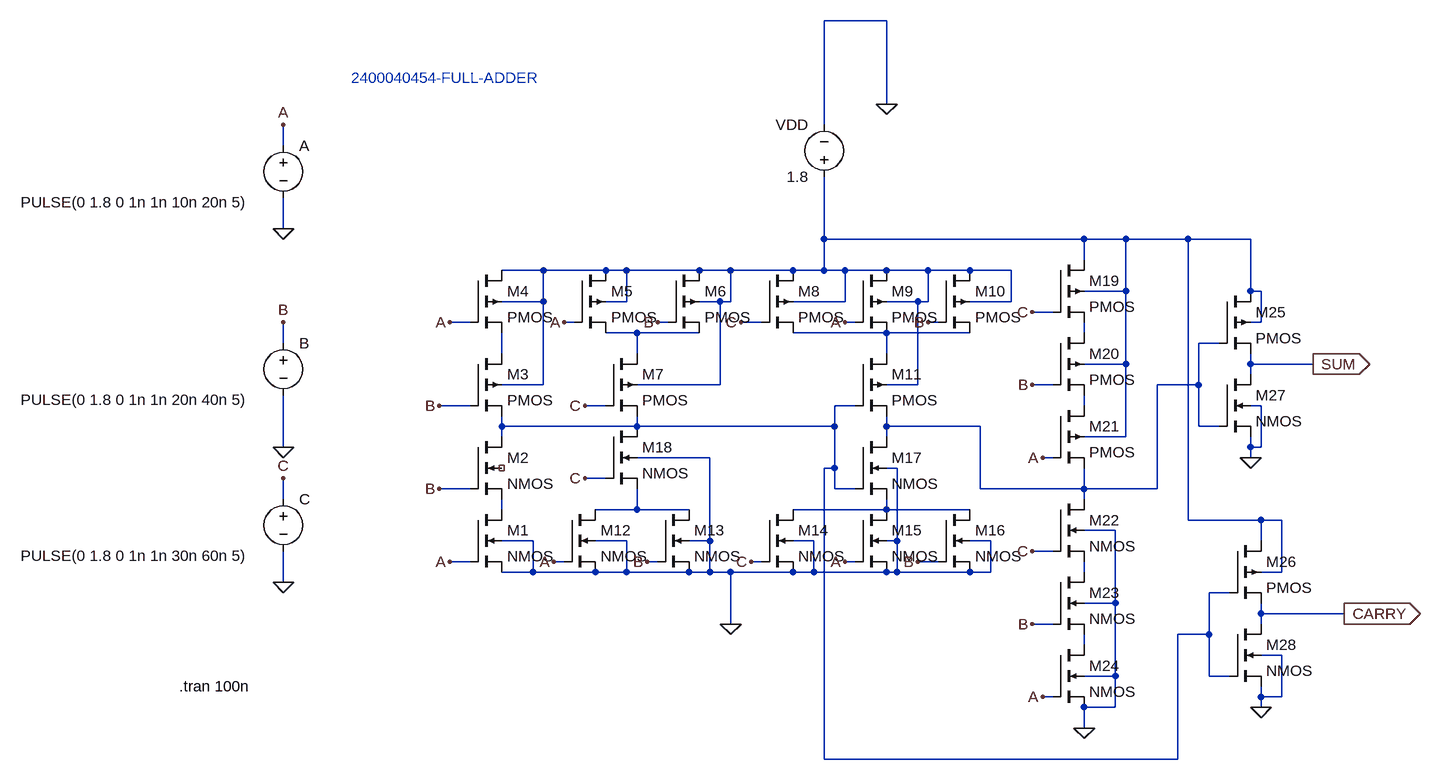
[diagram p0: schematic FULL-ADDER.asc]
FULL-ADDER.asc, the LTspice schematic file:
Version 4.1
SHEET 1 1404 680
WIRE 560 -512 464 -512
WIRE 560 -384 560 -512
WIRE 464 -352 464 -512
WIRE -368 -320 -368 -352
WIRE -368 -192 -368 -240
WIRE 464 -176 464 -272
WIRE 864 -176 464 -176
WIRE 928 -176 864 -176
WIRE 1024 -176 928 -176
WIRE 1120 -176 1024 -176
WIRE 864 -144 864 -176
WIRE 32 -128 -32 -128
WIRE 128 -128 32 -128
WIRE 160 -128 128 -128
WIRE 272 -128 160 -128
WIRE 320 -128 272 -128
WIRE 416 -128 320 -128
WIRE 464 -128 464 -176
WIRE 464 -128 416 -128
WIRE 496 -128 464 -128
WIRE 560 -128 496 -128
WIRE 624 -128 560 -128
WIRE 688 -128 624 -128
WIRE 752 -128 688 -128
WIRE 928 -96 928 -176
WIRE 928 -96 864 -96
WIRE 1120 -96 1120 -176
WIRE 1136 -96 1120 -96
WIRE 32 -80 32 -128
WIRE 32 -80 -32 -80
WIRE 160 -80 160 -128
WIRE 160 -80 128 -80
WIRE 304 -80 272 -80
WIRE 320 -80 320 -128
WIRE 320 -80 304 -80
WIRE 496 -80 496 -128
WIRE 496 -80 416 -80
WIRE 608 -80 560 -80
WIRE 624 -80 624 -128
WIRE 624 -80 608 -80
WIRE 752 -80 752 -128
WIRE 752 -80 688 -80
WIRE 816 -64 784 -64
WIRE -80 -48 -112 -48
WIRE 80 -48 64 -48
WIRE 224 -48 208 -48
WIRE 368 -48 336 -48
WIRE 512 -48 496 -48
WIRE 640 -48 624 -48
WIRE 1136 -48 1136 -96
WIRE 1136 -48 1120 -48
WIRE 176 -32 128 -32
WIRE 272 -32 176 -32
WIRE 560 -32 416 -32
WIRE 688 -32 560 -32
WIRE 864 -32 864 -48
WIRE -368 -16 -368 -48
WIRE 1072 -16 1040 -16
WIRE -32 0 -32 -32
WIRE 176 0 176 -32
WIRE 560 0 560 -32
WIRE 928 16 928 -96
WIRE 928 16 864 16
WIRE 1120 16 1120 0
WIRE 1216 16 1120 16
WIRE 1120 32 1120 16
WIRE 32 48 32 -80
WIRE 32 48 -32 48
WIRE 304 48 304 -80
WIRE 304 48 176 48
WIRE 608 48 608 -80
WIRE 608 48 560 48
WIRE 816 48 784 48
WIRE 1040 48 1040 -16
WIRE 1040 48 976 48
WIRE -80 80 -128 80
WIRE 128 80 96 80
WIRE 512 80 480 80
WIRE 864 80 864 64
WIRE 1136 80 1120 80
WIRE -32 112 -32 96
WIRE 176 112 176 96
WIRE 176 112 -32 112
WIRE 480 112 480 80
WIRE 480 112 176 112
WIRE 560 112 560 96
WIRE 704 112 560 112
WIRE 1040 112 1040 48
WIRE 1072 112 1040 112
WIRE -32 128 -32 112
WIRE 560 128 560 112
WIRE 928 128 928 16
WIRE 928 128 864 128
WIRE -368 144 -368 64
WIRE 1120 144 1120 128
WIRE 1136 144 1136 80
WIRE 1136 144 1120 144
WIRE 288 160 176 160
WIRE 816 160 800 160
WIRE 1120 160 1120 144
WIRE 480 176 480 112
WIRE 480 176 464 176
WIRE 576 176 560 176
WIRE 128 192 96 192
WIRE -80 208 -128 208
WIRE 480 208 480 176
WIRE 512 208 480 208
WIRE 704 208 704 112
WIRE 864 208 864 176
WIRE 864 208 704 208
WIRE 976 208 976 48
WIRE 976 208 864 208
WIRE -368 224 -368 192
WIRE 864 224 864 208
WIRE -32 240 -32 224
WIRE 176 240 176 208
WIRE 176 240 112 240
WIRE 256 240 176 240
WIRE 560 240 560 224
WIRE 560 240 416 240
WIRE 688 240 560 240
WIRE 1024 256 1024 -176
WIRE 1136 256 1024 256
WIRE 1168 256 1136 256
WIRE 912 272 864 272
WIRE 16 288 -32 288
WIRE 160 288 112 288
WIRE 288 288 288 160
WIRE 288 288 256 288
WIRE 448 288 416 288
WIRE 576 288 576 176
WIRE 576 288 560 288
WIRE 720 288 688 288
WIRE 1136 288 1136 256
WIRE 816 304 784 304
WIRE -80 320 -112 320
WIRE 64 320 48 320
WIRE 208 320 192 320
WIRE 368 320 352 320
WIRE 512 320 496 320
WIRE 640 320 608 320
WIRE 16 336 16 288
WIRE 16 336 -32 336
WIRE 112 336 16 336
WIRE 160 336 160 288
WIRE 160 336 112 336
WIRE 256 336 160 336
WIRE 288 336 288 288
WIRE 288 336 256 336
WIRE 320 336 288 336
WIRE 416 336 320 336
WIRE 448 336 448 288
WIRE 448 336 416 336
WIRE 560 336 448 336
WIRE 576 336 576 288
WIRE 576 336 560 336
WIRE 688 336 576 336
WIRE 720 336 720 288
WIRE 720 336 688 336
WIRE 864 336 864 320
WIRE 1168 336 1168 256
WIRE 1168 336 1136 336
WIRE -368 352 -368 304
WIRE 1088 368 1056 368
WIRE 912 384 912 272
WIRE 912 384 864 384
WIRE 1136 400 1136 384
WIRE 1264 400 1136 400
WIRE 320 416 320 336
WIRE 816 416 784 416
WIRE 1136 416 1136 400
WIRE 1056 432 1056 368
WIRE 1056 432 1008 432
WIRE 864 448 864 432
WIRE 1168 464 1136 464
WIRE 912 496 912 384
WIRE 912 496 864 496
WIRE 1056 496 1056 432
WIRE 1088 496 1056 496
WIRE 816 528 800 528
WIRE 1136 528 1136 512
WIRE 1168 528 1168 464
WIRE 1168 528 1136 528
WIRE 912 544 912 496
WIRE 912 544 864 544
WIRE 1136 544 1136 528
WIRE 864 576 864 544
WIRE 464 624 464 176
WIRE 1008 624 1008 432
WIRE 1008 624 464 624
FLAG 320 416 0
FLAG 864 576 0
FLAG 1120 160 0
FLAG 1136 544 0
FLAG 1216 16 SUM
IOPIN 1216 16 Out
FLAG 1264 400 CARRY
IOPIN 1264 400 Out
FLAG 560 -384 0
FLAG -368 -192 0
FLAG -368 144 0
FLAG -368 352 0
FLAG -112 -48 A
FLAG 64 -48 A
FLAG -112 320 A
FLAG 48 320 A
FLAG 496 320 A
FLAG 800 160 A
FLAG 800 528 A
FLAG 496 -48 A
FLAG -128 80 B
FLAG -128 208 B
FLAG 784 48 B
FLAG 784 416 B
FLAG 208 -48 B
FLAG 624 -48 B
FLAG 608 320 B
FLAG 192 320 B
FLAG 96 80 C
FLAG 96 192 C
FLAG 336 -48 C
FLAG 784 -64 C
FLAG 784 304 C
FLAG 352 320 C
FLAG -368 -352 A
FLAG -368 -48 B
FLAG -368 192 C
SYMBOL nmos4 -80 240 R0
SYMATTR InstName M1
SYMBOL nmos4 -80 128 R0
SYMATTR InstName M2
SYMBOL pmos4 -80 0 R0
SYMATTR InstName M3
SYMBOL pmos4 -80 -128 R0
SYMATTR InstName M4
SYMBOL pmos4 80 -128 R0
SYMATTR InstName M5
SYMBOL pmos4 224 -128 R0
SYMATTR InstName M6
SYMBOL pmos4 128 0 R0
SYMATTR InstName M7
SYMBOL pmos4 368 -128 R0
SYMATTR InstName M8
SYMBOL pmos4 512 -128 R0
SYMATTR InstName M9
SYMBOL pmos4 640 -128 R0
SYMATTR InstName M10
SYMBOL pmos4 512 0 R0
SYMATTR InstName M11
SYMBOL nmos4 64 240 R0
SYMATTR InstName M12
SYMBOL nmos4 208 240 R0
SYMATTR InstName M13
SYMBOL nmos4 368 240 R0
SYMATTR InstName M14
SYMBOL nmos4 512 240 R0
SYMATTR InstName M15
SYMBOL nmos4 640 240 R0
SYMATTR InstName M16
SYMBOL nmos4 512 128 R0
SYMATTR InstName M17
SYMBOL nmos4 128 112 R0
SYMATTR InstName M18
SYMBOL pmos4 816 -144 R0
SYMATTR InstName M19
SYMBOL pmos4 816 -32 R0
SYMATTR InstName M20
SYMBOL pmos4 816 80 R0
SYMATTR InstName M21
SYMBOL nmos4 816 224 R0
SYMATTR InstName M22
SYMBOL nmos4 816 336 R0
SYMATTR InstName M23
SYMBOL nmos4 816 448 R0
SYMATTR InstName M24
SYMBOL pmos4 1072 -96 R0
SYMATTR InstName M25
SYMBOL pmos4 1088 288 R0
SYMATTR InstName M26
SYMBOL nmos4 1072 32 R0
SYMATTR InstName M27
SYMBOL nmos4 1088 416 R0
SYMATTR InstName M28
SYMBOL voltage 464 -256 R180
WINDOW 0 24 96 Left 2
WINDOW 3 24 16 Left 2
WINDOW 123 0 0 Left 0
WINDOW 39 0 0 Left 0
SYMATTR InstName VDD
SYMATTR Value 1.8
SYMBOL voltage -368 -336 R0
WINDOW 3 -404 103 Left 2
WINDOW 123 0 0 Left 0
WINDOW 39 0 0 Left 0
SYMATTR Value PULSE(0 1.8 0 1n 1n 10n 20n 5)
SYMATTR InstName A
SYMBOL voltage -368 -32 R0
WINDOW 3 -404 103 Left 2
WINDOW 123 0 0 Left 0
WINDOW 39 0 0 Left 0
SYMATTR Value PULSE(0 1.8 0 1n 1n 20n 40n 5)
SYMATTR InstName B
SYMBOL voltage -368 208 R0
WINDOW 3 -404 103 Left 2
WINDOW 123 0 0 Left 0
WINDOW 39 0 0 Left 0
SYMATTR Value PULSE(0 1.8 0 1n 1n 30n 60n 5)
SYMATTR InstName C
TEXT -528 512 Left 2 !.tran 100n
TEXT -264 -424 Left 2 ;2400040454-FULL-ADDER

The netlist it stands for:
* FULL-ADDER.asc
M1 N009 A 0 0 NMOS
M2 N007 B N009 NC_01 NMOS
M3 N006 B N007 N001 PMOS
M4 N001 A N006 N001 PMOS
M5 N001 A N002 N001 PMOS
M6 N001 B N002 N001 PMOS
M7 N002 C N007 N001 PMOS
M8 N001 C N003 N001 PMOS
M9 N001 A N003 N001 PMOS
M10 N001 B N003 N001 PMOS
M11 N003 N007 N005 N001 PMOS
M12 N010 A 0 0 NMOS
M13 N010 B 0 0 NMOS
M14 N011 C 0 0 NMOS
M15 N011 A 0 0 NMOS
M16 N011 B 0 0 NMOS
M17 N005 N007 N011 0 NMOS
M18 N007 C N010 0 NMOS
M19 N001 C N004 N001 PMOS
M20 N004 B N008 N001 PMOS
M21 N008 A N005 N001 PMOS
M22 N005 C N012 0 NMOS
M23 N012 B N013 0 NMOS
M24 N013 A 0 0 NMOS
M25 N001 N005 SUM N001 PMOS
M26 N001 N007 CARRY N001 PMOS
M27 SUM N005 0 0 NMOS
M28 CARRY N007 0 0 NMOS
VDD N001 0 1.8
V§A A 0 PULSE(0 1.8 0 1n 1n 10n 20n 5)
V§B B 0 PULSE(0 1.8 0 1n 1n 20n 40n 5)
V§C C 0 PULSE(0 1.8 0 1n 1n 30n 60n 5)
.model NMOS NMOS
.model PMOS PMOS
.lib standard.mos
.tran 100n
* 2400040454-FULL-ADDER
.backanno
.end